# Altium schematic sheet EN-C200-OPT_RA1.SchDoc
size A4
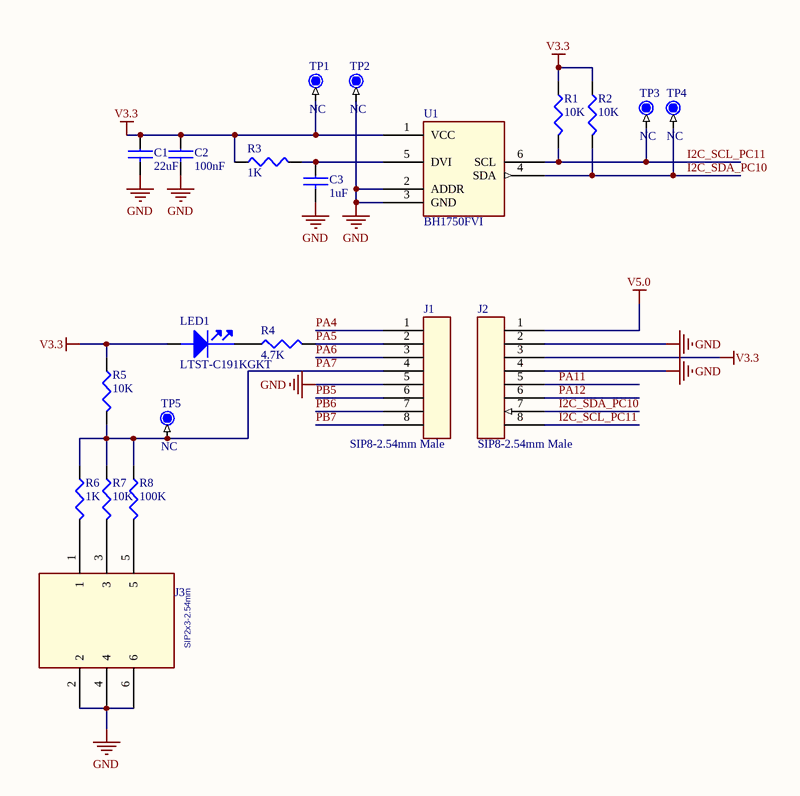
[diagram p0: EN-C200-OPT_RA1.SchDoc]

## Parts
C1  22uF  [SC0805]
C2  100nF  [SC0603]
C3  1uF  [SC0603]
J1  SIP8-2.54mm Male  [SIP-8P-100]
J2  SIP8-2.54mm Male  [SIP-8P-100]
J3  SIP2x3-2.54mm  [SIP-2x3P-100]
LED1  LTST-C191KGKT  [HSD0603-LED]
R1  10K  [SR0603]
R2  10K  [SR0603]
R3  1K  [SR0603]
R4  4.7K  [SR0603]
R5  10K  [SR0603]
R6  1K  [SR0603]
R7  10K  [SR0603]
R8  100K  [SR0603]
TP1  NC  [TP32-SMD]
TP2  NC  [TP32-SMD]
TP3  NC  [TP32-SMD]
TP4  NC  [TP32-SMD]
TP5  NC  [TP32-SMD]
U1  BH1750FVI  [sop6-20-105]

## Nets
GND: C1.2 C2.2 C3.2 J1.5 J2.2 J2.4 J3.2 J3.4 J3.6 TP2.1 U1.2(ADDR) U1.3(GND)
V3.3: C1.1 C2.1 J2.3 LED1.1 R1.1 R2.1 R3.1 R5.1 TP1.1 U1.1(VCC)
V5.0: J2.1
I2C_SCL_PC11: J2.8 R1.2 TP3.1 U1.6(SCL)
I2C_SDA_PC10: J2.7 R2.2 TP4.1 U1.4(SDA)
PA4: J1.1
PA5: J1.2 R4.2
PA6: J1.3
PA7: J1.4 R5.2 R6.1 R7.1 R8.1 TP5.1
PA11: J2.5
PA12: J2.6
PB5: J1.6
PB6: J1.7
PB7: J1.8
NetC3_1: C3.1 R3.2 U1.5(DVI)
NetJ3_1: J3.1 R6.2
NetJ3_3: J3.3 R7.2
NetJ3_5: J3.5 R8.2
NetLED1_2: LED1.2 R4.1

## Library data of the parts
C1 = CAP NP: Y5V-10V/-25℃～+85℃/(-20%～+80%)
C2 = CAP NP: X5R-50V/-55℃～+85℃/(±10%)
C3 = CAP NP: X5R-16V/-55℃～+85℃/(±10%)
J1 J2 = HEADER8: 8Pin 2.54mm謗賜髓�-驟埼ｫ�10mm/-40邃��ｽ�+105邃�
J3 = CON2X3: 2x3Pin 2.54mm謗賜髓�-驟埼ｫ�10mm/-40邃��ｽ�+105邃�
LED1 = LED: 绿色LED 2V-30mA/-55℃～+85℃
R1-R8 = RESISTOR: 碳膜-1/10W/-55℃～+155℃/5%
TP1-TP5 = TP: 0.8MM焊盘
U1 = BH1750HVI: 16菴肴焚蟄苓ｾ灘�ｺ蝙狗試ｯ蠅�蜈牙ｼｺ蠎ｦ莨諢溷勣�ｼ栗2C BUS/-40邃�+85邃�